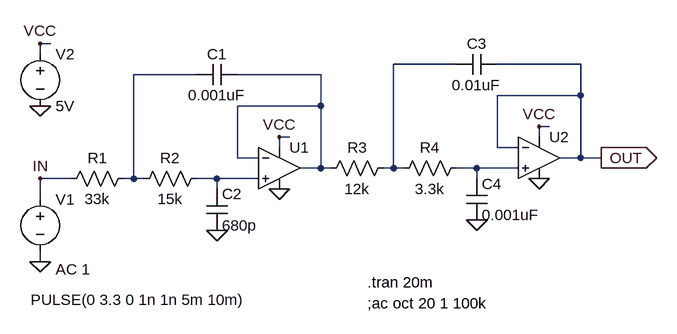
[diagram p0: schematic ArduinoLFO_VCVS_4thLPF_r.asc]
ArduinoLFO_VCVS_4thLPF_r.asc, the LTspice schematic file:
Version 4
SHEET 1 900 680
WIRE -128 -16 -144 -16
WIRE -144 0 -144 -16
WIRE 496 16 400 16
WIRE 688 16 560 16
WIRE 96 32 0 32
WIRE 288 32 160 32
WIRE 688 64 688 16
WIRE 688 64 560 64
WIRE 288 80 288 32
WIRE 288 80 160 80
WIRE 640 112 624 112
WIRE 240 128 224 128
WIRE 624 128 624 112
WIRE 224 144 224 128
WIRE 560 144 560 64
WIRE 592 144 560 144
WIRE 160 160 160 80
WIRE 192 160 160 160
WIRE 688 160 688 64
WIRE 688 160 656 160
WIRE 720 160 688 160
WIRE 288 176 288 80
WIRE 288 176 256 176
WIRE 304 176 288 176
WIRE 400 176 400 16
WIRE 400 176 384 176
WIRE 416 176 400 176
WIRE 528 176 496 176
WIRE 592 176 528 176
WIRE -96 192 -144 192
WIRE 0 192 0 32
WIRE 0 192 -16 192
WIRE 16 192 0 192
WIRE 128 192 96 192
WIRE 192 192 128 192
WIRE 528 192 528 176
WIRE 128 208 128 192
WIRE -144 224 -144 192
WIRE -144 320 -144 304
FLAG 224 208 0
FLAG 128 272 0
FLAG 224 128 VCC
FLAG -144 320 0
FLAG 720 160 OUT
IOPIN 720 160 Out
FLAG -144 80 0
FLAG -144 -16 VCC
FLAG -144 192 IN
FLAG 624 192 0
FLAG 528 256 0
FLAG 624 112 VCC
SYMBOL Opamps\\UniversalOpamp2 224 176 R0
SYMATTR InstName U1
SYMBOL cap 160 16 R90
WINDOW 0 0 32 VBottom 2
WINDOW 3 32 32 VTop 2
SYMATTR InstName C1
SYMATTR Value 0.001uF
SYMBOL res 0 176 R90
WINDOW 0 0 56 VBottom 2
WINDOW 3 32 56 VTop 2
SYMATTR InstName R1
SYMATTR Value 33k
SYMBOL res 112 176 R90
WINDOW 0 0 56 VBottom 2
WINDOW 3 32 56 VTop 2
SYMATTR InstName R2
SYMATTR Value 15k
SYMBOL cap 112 208 R0
SYMATTR InstName C2
SYMATTR Value 680p
SYMBOL voltage -144 208 R0
WINDOW 123 24 124 Left 2
WINDOW 39 0 0 Left 2
WINDOW 3 -15 171 Left 2
SYMATTR Value2 AC 1
SYMATTR Value PULSE(0 3.3 0 1n 1n 5m 10m)
SYMATTR InstName V1
SYMBOL voltage -144 -16 R0
SYMATTR InstName V2
SYMATTR Value 5V
SYMBOL Opamps\\UniversalOpamp2 624 160 R0
SYMATTR InstName U2
SYMBOL cap 560 0 R90
WINDOW 0 0 32 VBottom 2
WINDOW 3 32 32 VTop 2
SYMATTR InstName C3
SYMATTR Value 0.01uF
SYMBOL res 400 160 R90
WINDOW 0 0 56 VBottom 2
WINDOW 3 32 56 VTop 2
SYMATTR InstName R3
SYMATTR Value 12k
SYMBOL res 512 160 R90
WINDOW 0 0 56 VBottom 2
WINDOW 3 32 56 VTop 2
SYMATTR InstName R4
SYMATTR Value 3.3k
SYMBOL cap 512 192 R0
SYMATTR InstName C4
SYMATTR Value 0.001uF
TEXT 360 384 Left 2 !;ac oct 20 1 100k
TEXT 360 352 Left 2 !.tran 20m

The netlist it stands for:
* ArduinoLFO_VCVS_4thLPF_r.asc
XU1 N005 N003 VCC 0 N003 level.2 Avol=1Meg GBW=10Meg Slew=10Meg ilimit=25m rail=0 Vos=0 phimargin=45 en=0 enk=0 in=0 ink=0 Rin=500Meg  ; pins IN+ IN- V+ V- OUT
C1 N003 N002 0.001uF
R1 N002 IN 33k
R2 N005 N002 15k
C2 N005 0 680p
V1 IN 0 PULSE(0 3.3 0 1n 1n 5m 10m) AC 1
V2 VCC 0 5V
XU2 N004 OUT VCC 0 OUT level.2 Avol=1Meg GBW=10Meg Slew=10Meg ilimit=25m rail=0 Vos=0 phimargin=45 en=0 enk=0 in=0 ink=0 Rin=500Meg  ; pins IN+ IN- V+ V- OUT
C3 OUT N001 0.01uF
R3 N001 N003 12k
R4 N004 N001 3.3k
C4 N004 0 0.001uF
;ac oct 20 1 100k
.tran 20m
.lib UniversalOpamps2.sub
.backanno
.end